# EAGLE design module-template (EAGLE 6.2)
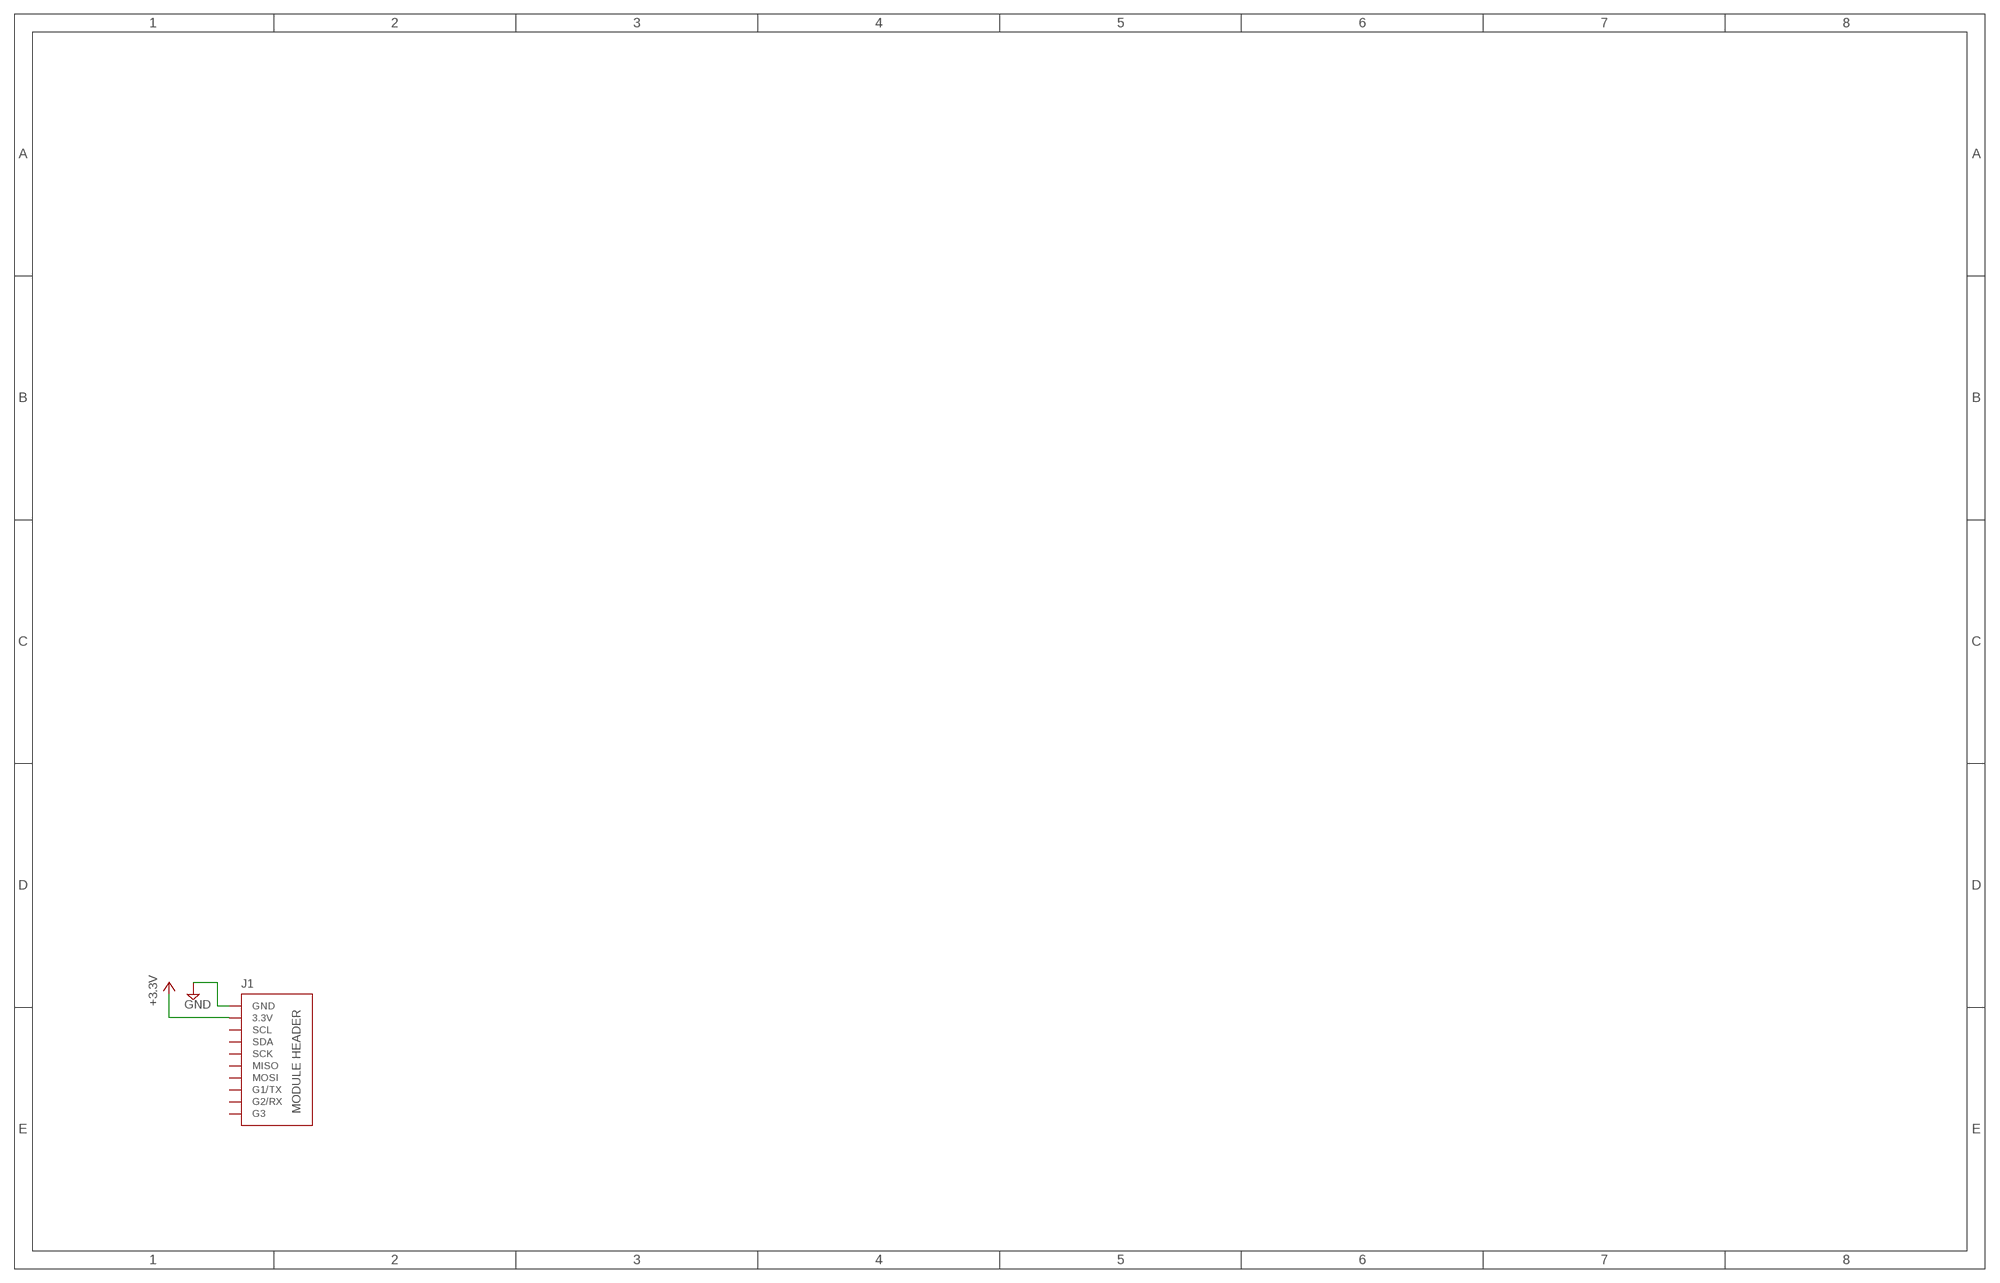
[diagram p0: schematic, sheet 1]

## Parts
J1  MODULE_HEADER_MODULEDEFAULT  [MODULE_HEADER_MODULE]

## Nets
+3.3V: J1.3.3V
GND: J1.GND
Unconnected: J1.G1/TX J1.G2/RX J1.G3 J1.MISO J1.MOSI J1.SCK J1.SCL J1.SDA

## Library data of the parts
J1 = tm:MODULE_HEADER_MODULE

## Board
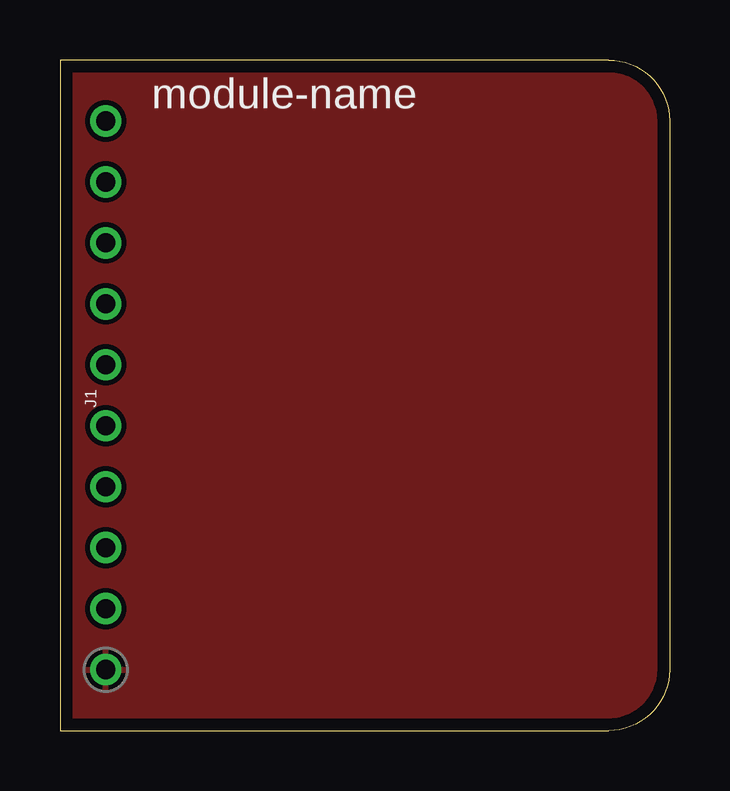
[diagram p1: board, top side]
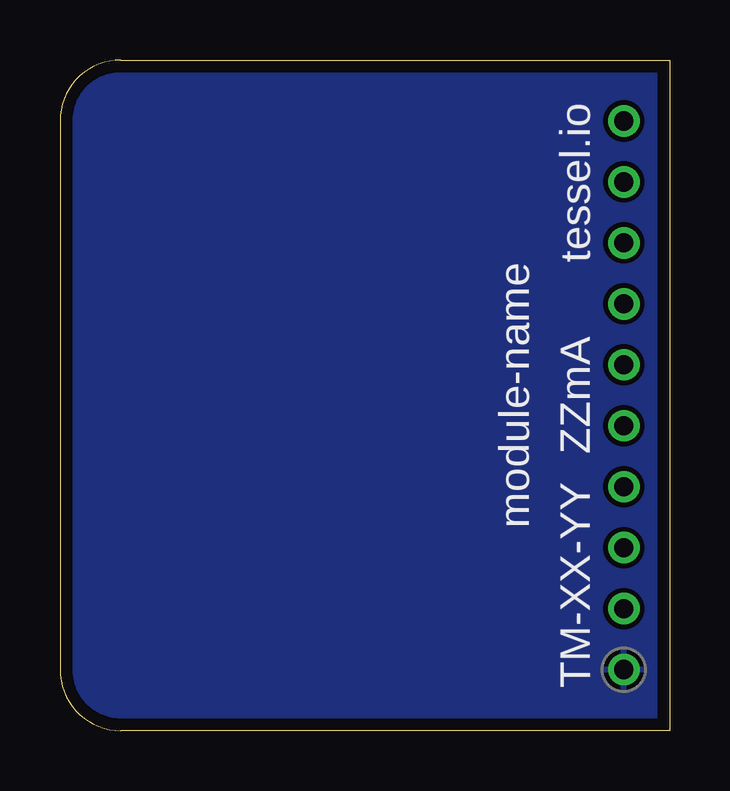
[diagram p2: board, bottom side, seen from below]

Size 25.4 x 27.94 mm. Coordinates in mm from the lower left corner, seen from the top.
Outline: 0,0 22.86,0 arc90 25.4,2.54 25.4,25.4 arc90 22.86,27.94 0,27.94 0,0
Copper layers (1*16): Top 0.035mm / dielectric 1.5mm / Bottom 0.035mm
Design rules: minimum track width 8mil, minimum drill 24mil, track to track 8mil, track to pad 8mil, pad to pad 8mil, via to via 8mil, smd to smd 8mil, copper to edge 20mil, drill to drill 8mil, minimum pad ring 10mil, minimum via ring 8mil, stop-mask expansion 4mil, vias tented up to drill 0mil, thermal gap 10mil

### Footprints (pad centres in the part's own frame; a part is rotated, then mirrored left to right if it is on the bottom)
MODULE_HEADER_MODULE = drill 0.8: 3.3V -8.89,0; G1/TX 6.35,0; G2/RX 8.89,0; G3 11.43,0; GND -11.43,0; MISO 1.27,0; MOSI 3.81,0; SCK -1.27,0; SCL -6.35,0; SDA -3.81,0

### Placement (x,y rotation side)
J1  1.91,13.97 90 top

### Tracks (layer width: path | path; a pad name or v marks a point on that pad's centre or on a via)
GND
  pour Bottom: 0.51,0.51 0.51,27.43 22.86,27.43 arc-90 24.89,25.4 24.89,2.54 arc-90 22.86,0.51
  pour Top: 0.51,0.51 0.51,27.43 22.86,27.43 arc-90 24.89,25.4 24.89,2.54 arc-90 22.86,0.51

### Text on the board
tNames: module-name
bNames: tessel.io | ZZmA | module-name | TM-XX-YY